# Altium schematic sheet 07-modem1.SchDoc: Modem
size Letter; DrawnBy: J. Brinton; Engineer: J. Brinton; Revision: 1; SheetNumber: 7; SheetTotal: 14
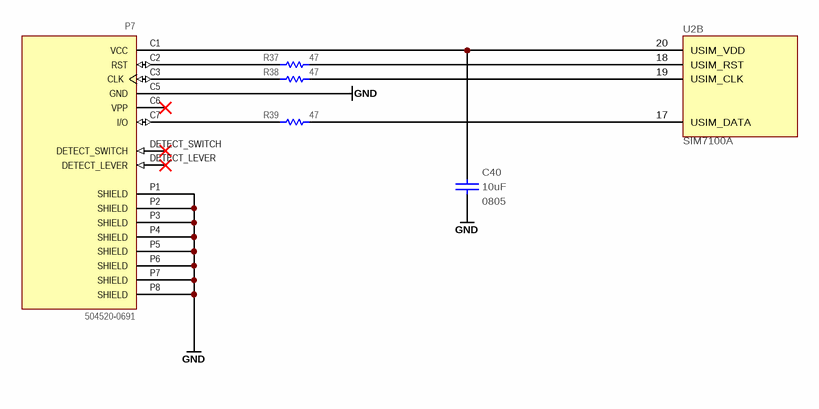
[diagram p0: 07-modem1.SchDoc]

## Parts
C40  value 10uF  Package: 0805  [CAPC200X125X145L45N]  (hidden comment: CL21B106KOQNNNE)
P7  504520-0691  [504520-0691]
R37  value 47  [RESC2012X70N]  (hidden comment: ERJ-6ENF47R0V)
R38  value 47  [RESC2012X70N]  (hidden comment: ERJ-6ENF47R0V)
R39  value 47  [RESC2012X70N]  (hidden comment: ERJ-6ENF47R0V)
U2  SIM7100A  [SIM7100A]  (part B of 10)

## Nets
GND: C40.2 P7.C5(GND) P7.P1(SHIELD) P7.P2(SHIELD) P7.P3(SHIELD) P7.P4(SHIELD) P7.P5(SHIELD) P7.P6(SHIELD) P7.P7(SHIELD) P7.P8(SHIELD)
NetC40_1: C40.1 P7.C1(VCC) U2.20(USIM_VDD)
NetP7_C2: P7.C2(RST) R37.2
NetP7_C3: P7.C3(CLK) R38.2
NetP7_C7: P7.C7(I/O) R39.2
NetR37_1: R37.1 U2.18(USIM_RST)
NetR38_1: R38.1 U2.19(USIM_CLK)
NetR39_1: R39.1 U2.17(USIM_DATA)

Not connected (* = marked no-connect by the designer): P7 C6(VPP)* DETECT_LEVER* DETECT_SWITCH*

## Notes on the sheet
- Designed By:
- Title
- Engineer
- Revision
- Drawn By
- Date
- Sheet
- of

## Library data of the parts
C40 = LMK212B7106KG: Ceramic Capacitor 10uF ±10% 16V X7R 0805; Manufacturer: Samsung; Tr: -55:105; Manufacturer P/N: CL21B106KOQNNNE; Tolerance: ±10%; Voltage: 16V
P7 = 504520-0691: micro-SIM Card Connector; Manufacturer: Molex; Availability: Good; Package: None; Manufacturer P/N: 504520-0691; Price: 1.31 USD; Value: *
R37-R39 = RES 0402: Thick Film Resistor 47 ±1% 0805; Manufacturer: Panasonic; Tr: -55:155; Package: 0805; Manufacturer P/N: ERJ-6ENF47R0V; Tolerance: ±1%
U2 = Component_1: Cellular Module; Manufacturer: SIMCOM; Manufacturer P/N: SIM7100A